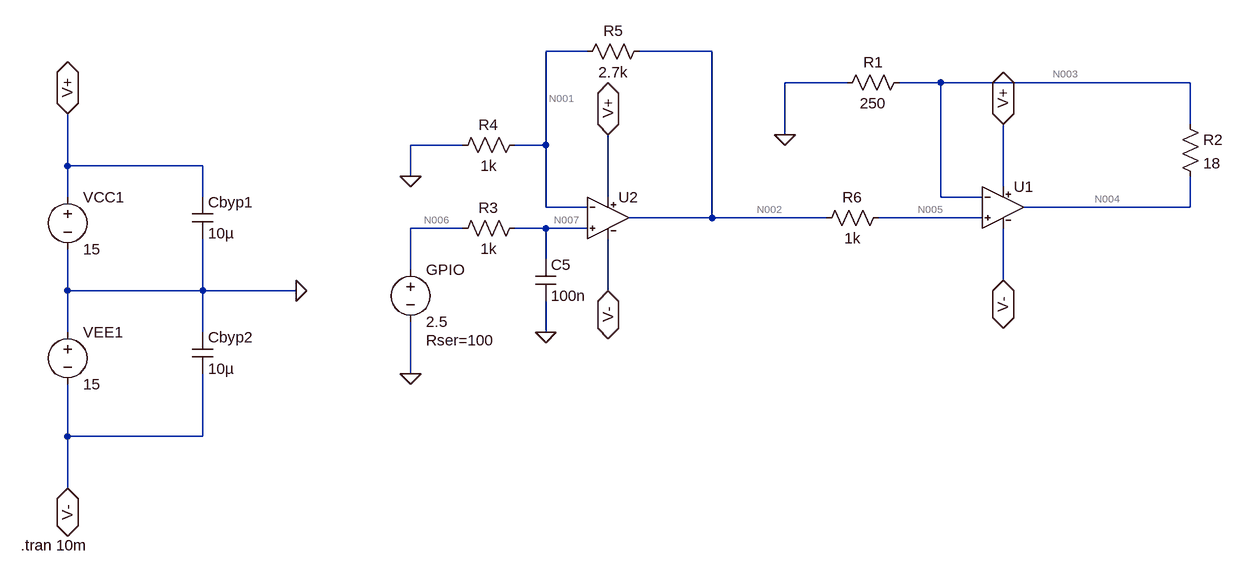
[diagram p0: schematic heatpad.asc]
heatpad.asc, the LTspice schematic file:
Version 4
SHEET 1 2604 692
WIRE 112 -160 48 -160
WIRE 304 -160 192 -160
WIRE 512 -112 416 -112
WIRE 656 -112 592 -112
WIRE 1040 -112 656 -112
WIRE 1040 -48 1040 -112
WIRE 416 -32 416 -112
WIRE -80 -16 -160 -16
WIRE 48 -16 48 -160
WIRE 48 -16 0 -16
WIRE -688 16 -688 -64
WIRE -480 16 -688 16
WIRE -160 32 -160 -16
WIRE 752 48 752 -48
WIRE -688 64 -688 16
WIRE -480 64 -480 16
WIRE 144 64 144 -32
WIRE 656 64 656 -112
WIRE 720 64 656 64
WIRE 48 80 48 -16
WIRE 112 80 48 80
WIRE 1040 80 1040 32
WIRE 1040 80 784 80
WIRE 304 96 304 -160
WIRE 304 96 176 96
WIRE 480 96 304 96
WIRE 720 96 560 96
WIRE -80 112 -160 112
WIRE 48 112 0 112
WIRE 112 112 48 112
WIRE 48 160 48 112
WIRE -160 176 -160 112
WIRE 752 192 752 112
WIRE -688 208 -688 144
WIRE -480 208 -480 128
WIRE -480 208 -688 208
WIRE -336 208 -480 208
WIRE 144 208 144 128
WIRE -688 272 -688 208
WIRE -480 272 -480 208
WIRE 48 272 48 224
WIRE -160 336 -160 256
WIRE -688 432 -688 352
WIRE -480 432 -480 336
WIRE -480 432 -688 432
WIRE -688 512 -688 432
FLAG -688 -64 V+
IOPIN -688 -64 BiDir
FLAG -688 512 V-
IOPIN -688 512 BiDir
FLAG -336 208 0
FLAG -160 336 0
FLAG 752 -48 V+
IOPIN 752 -48 BiDir
FLAG 752 192 V-
IOPIN 752 192 BiDir
FLAG 416 -32 0
FLAG 144 -32 V+
IOPIN 144 -32 BiDir
FLAG 144 208 V-
IOPIN 144 208 BiDir
FLAG 48 272 0
FLAG -160 32 0
SYMBOL voltage -688 48 R0
WINDOW 123 0 0 Left 0
WINDOW 39 0 0 Left 0
SYMATTR InstName VCC1
SYMATTR Value 15
SYMBOL voltage -688 256 R0
WINDOW 123 0 0 Left 0
WINDOW 39 0 0 Left 0
SYMATTR InstName VEE1
SYMATTR Value 15
SYMBOL cap -496 64 R0
SYMATTR InstName Cbyp1
SYMATTR Value 10µ
SYMBOL cap -496 272 R0
SYMATTR InstName Cbyp2
SYMATTR Value 10µ
SYMBOL voltage -160 160 R0
WINDOW 123 0 0 Left 0
WINDOW 39 24 124 Left 2
SYMATTR SpiceLine Rser=100
SYMATTR InstName GPIO
SYMATTR Value 2.5
SYMBOL TL974 752 80 R0
SYMATTR InstName U1
SYMBOL res 608 -128 R90
WINDOW 0 0 56 VBottom 2
WINDOW 3 32 56 VTop 2
SYMATTR InstName R1
SYMATTR Value 250
SYMBOL res 1024 -64 R0
SYMATTR InstName R2
SYMATTR Value 18
SYMBOL TL974 144 96 R0
SYMATTR InstName U2
SYMBOL res 16 96 R90
WINDOW 0 0 56 VBottom 2
WINDOW 3 32 56 VTop 2
SYMATTR InstName R3
SYMATTR Value 1k
SYMBOL cap 32 160 R0
SYMATTR InstName C5
SYMATTR Value 100n
SYMBOL res 16 -32 R90
WINDOW 0 0 56 VBottom 2
WINDOW 3 32 56 VTop 2
SYMATTR InstName R4
SYMATTR Value 1k
SYMBOL res 208 -176 R90
WINDOW 0 0 56 VBottom 2
WINDOW 3 32 56 VTop 2
SYMATTR InstName R5
SYMATTR Value 2.7k
SYMBOL res 576 80 R90
WINDOW 0 0 56 VBottom 2
WINDOW 3 32 56 VTop 2
SYMATTR InstName R6
SYMATTR Value 1k
TEXT -760 600 Left 2 !.tran 10m

The netlist it stands for:
* heatpad.asc
VCC1 V+ 0 15
VEE1 0 V- 15
Cbyp1 V+ 0 10µ
Cbyp2 0 V- 10µ
V§GPIO N006 0 2.5 Rser=100
XU1 N005 N003 V+ V- N004 TL974  ; pins INP INN VCC VEE OUT
R1 N003 0 250
R2 N003 N004 18
XU2 N007 N001 V+ V- N002 TL974  ; pins INP INN VCC VEE OUT
R3 N007 N006 1k
C5 N007 0 100n
R4 N001 0 1k
R5 N002 N001 2.7k
R6 N005 N002 1k
.tran 10m
.lib TL974.mod
.backanno
.end

* Results of the author's LTspice run, read from the files saved beside the schematic
* Operating Point, zero values left out:
*   V(v+) = 15 V
*   V(v-) = -15 V
*   V(n006) = 2.5 V
*   V(n005) = 5.026 V
*   V(n003) = 351.2 mV
*   V(n004) = 376.5 mV
*   V(n007) = 2.5 V
*   V(n001) = 1.358 V
*   V(n002) = 5.026 V
*   I(R1) = 1.405 mA
*   I(R2) = -1.405 mA
*   I(R3) = 210 nA
*   I(R4) = 1.358 mA
*   I(R5) = 1.358 mA
*   I(R6) = 210 nA
*   I(Vcc1) = -4 mA
*   I(Vee1) = -4 mA
*   I(Gpio) = 210 nA
*   Ix(u1:INP) = -210 nA
*   Ix(u1:INN) = -200 nA
*   Ix(u1:VCC) = 2 mA
*   Ix(u1:VEE) = -2 mA
*   Ix(u1:OUT) = -1.405 mA
*   Ix(u2:INP) = -210 nA
*   Ix(u2:INN) = -200 nA
*   Ix(u2:VCC) = 2 mA
*   Ix(u2:VEE) = -2 mA
*   Ix(u2:OUT) = -1.358 mA